# Altium schematic sheet FT2232HL_IN.SchDoc
size 297 x 209 mm; SheetNumber: 25; SheetTotal: 29
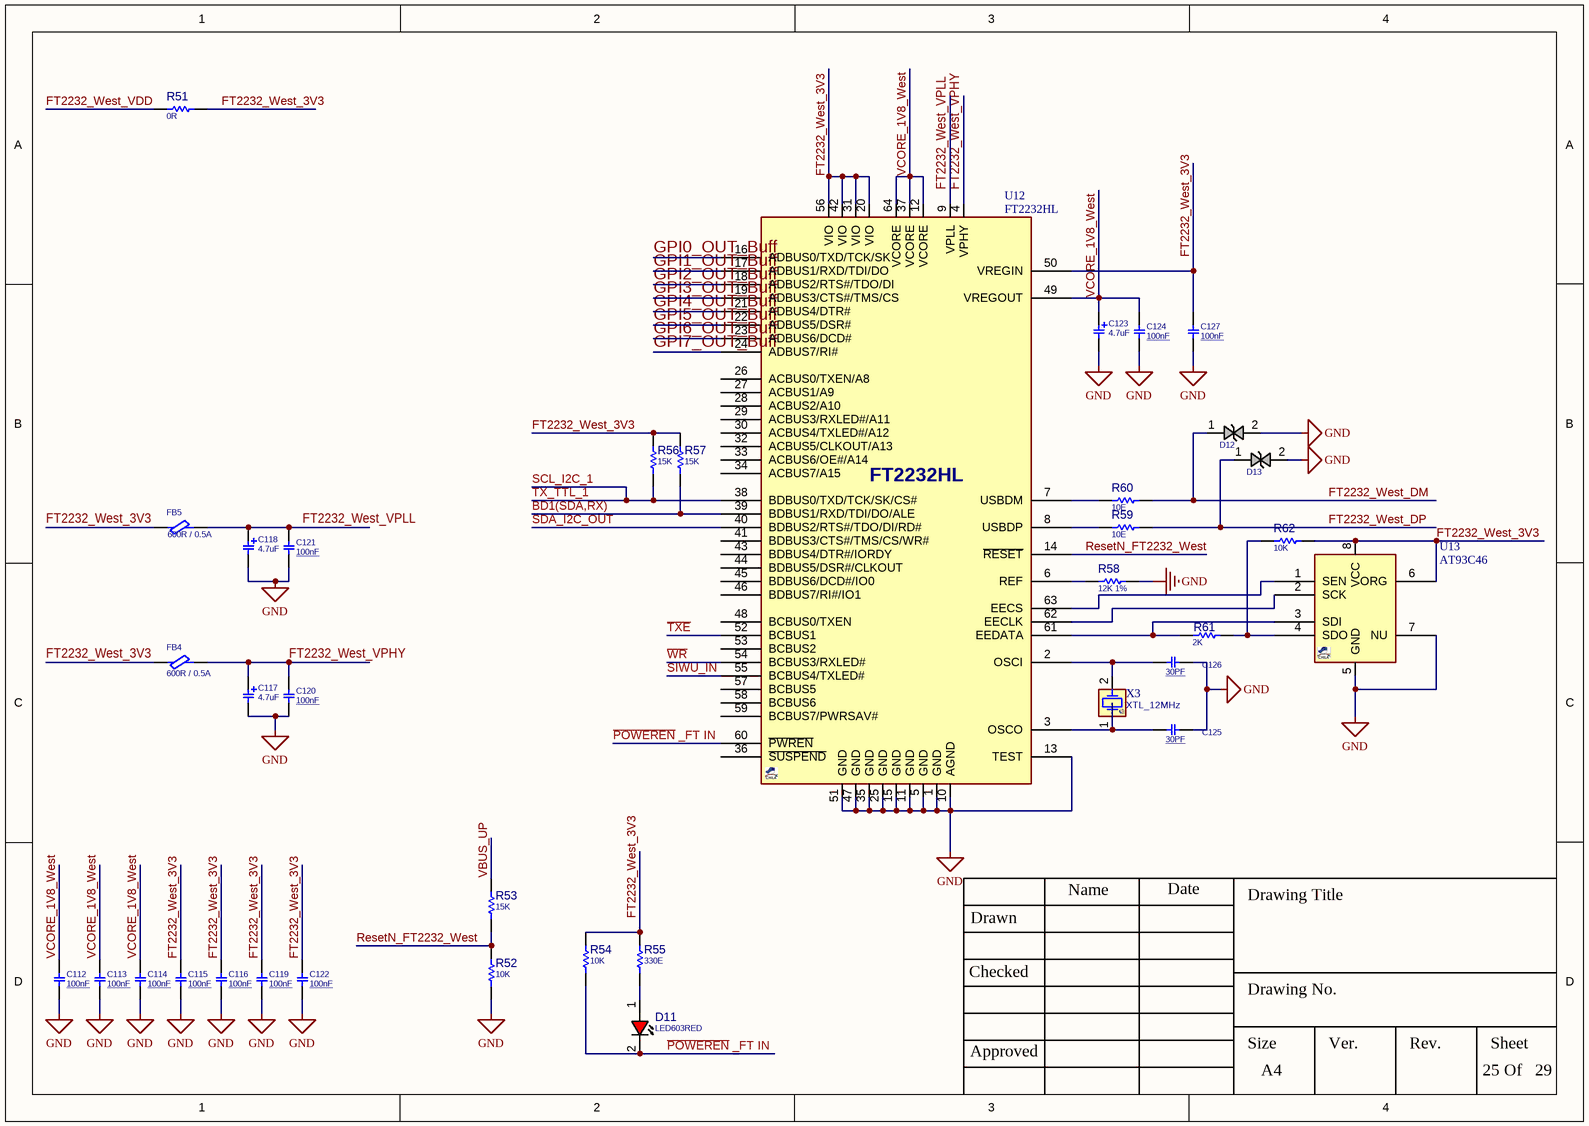
[diagram p0: FT2232HL_IN.SchDoc]

## Parts
C112  100nF  [0603]
C113  100nF  [0603]
C114  100nF  [0603]
C115  100nF  [0603]
C116  100nF  [0603]
C117  4.7uF  [C_TN_3216]
C118  4.7uF  [C_TN_3216]
C119  100nF  [0603]
C120  100nF  [0603]
C121  100nF  [0603]
C122  100nF  [0603]
C123  4.7uF  [C_TN_3216]
C124  100nF  [0603]
C125  30PF  [C0805]
C126  30PF  [C0805]
C127  100nF  [0603]
D11  LED603RED  [LED0603RED]
D12  TVS603  [D0603]  (value not drawn)
D13  TVS603  [D0603]  (value not drawn)
FB4  600R / 0.5A  [L0603]
FB5  600R / 0.5A  [L0603]
R51  0R  [R0603]
R52  10K  [R0603]
R53  15K  [R0603]
R54  10K  [R0603]
R55  330E  [R0603]
R56  15K  [R0603]
R57  15K  [R0603]
R58  value 12K 1%  [R025W_AX04]  (hidden comment: 12K)
R59  10E  [R0603]
R60  10E  [R0603]
R61  value 2K  [R025W_AX04]  (hidden comment: 12K)
R62  value 10K  [R025W_AX04]  (hidden comment: 12K)
U12  FT2232HL  [QFG50_64]
U13  AT93C46  [SO_8]
X3  XTL_12MHz  [XTL_2_11X5]

## Nets
GND: C112.2 C113.2 C114.2 C115.2 C116.2 C117.2 C118.2 C119.2 C120.2 C121.2 C122.2 C123.2 C124.2 C125.2 C126.2 C127.2 D12.2 D13.2 R52.2 R58.1 U12.1(GND) U12.5(GND) U12.10(AGND) U12.11(GND) U12.13(TEST) U12.15(GND) U12.25(GND) U12.35(GND) U12.47(GND) U12.51(GND) U13.5(GND) U13.7(NU)
~{POWEREN} _FT IN: D11.2(CATHODE) R54.2 U12.60(~{PWREN})
BD1(SDA,RX): R57.2 U12.39(BDBUS1/RXD/TDI/DO/ALE)
FT2232_West_3V3: C115.1 C116.1 C119.1 C122.1 C127.1 FB4.1 FB5.1 R51.2 R54.1 R55.1 R56.1 R57.1 R62.1 U12.20(VIO) U12.31(VIO) U12.42(VIO) U12.50(VREGIN) U12.56(VIO) U13.6(ORG) U13.8(VCC)
FT2232_West_DM: D12.1 R60.1
FT2232_West_DP: D13.1 R59.1
FT2232_West_VDD: R51.1
FT2232_West_VPHY: C117.1 C120.1 FB4.2 U12.4(VPHY)
FT2232_West_VPLL: C118.1 C121.1 FB5.2 U12.9(VPLL)
GPI0_OUT_Buff: U12.16(ADBUS0/TXD/TCK/SK)
GPI1_OUT_Buff: U12.17(ADBUS1/RXD/TDI/DO)
GPI2_OUT_Buff: U12.18(ADBUS2/RTS#/TDO/DI)
GPI3_OUT_Buff: U12.19(ADBUS3/CTS#/TMS/CS)
GPI4_OUT_Buff: U12.21(ADBUS4/DTR#)
GPI5_OUT_Buff: U12.22(ADBUS5/DSR#)
GPI6_OUT_Buff: U12.23(ADBUS6/DCD#)
GPI7_OUT_Buff: U12.24(ADBUS7/RI#)
ResetN_FT2232_West: R52.1 R53.2 U12.14(~{RESET})
SCL_I2C_1: R56.2 U12.38(BDBUS0/TXD/TCK/SK/CS#)  [also labelled TX_TTL_1]
SDA_I2C_OUT: U12.40(BDBUS2/RTS#/TDO/DI/RD#)
SIWU_IN: U12.55(BCBUS4/TXLED#)
~{TXE}: U12.52(BCBUS1)
VBUS_UP: R53.1
VCORE_1V8_West: C112.1 C113.1 C114.1 C123.1 C124.1 U12.12(VCORE) U12.37(VCORE) U12.49(VREGOUT) U12.64(VCORE)
~{WR}: U12.54(BCBUS3/RXLED#)
NetC125_1: C125.1 U12.3(OSCO) X3.1(OSC1)
NetC126_1: C126.1 U12.2(OSCI) X3.2(OSC2)
NetD11_1: D11.1(ANODE) R55.2
NetR58_2: R58.2 U12.6(REF)
NetR59_2: R59.2 U12.8(USBDP)
NetR60_2: R60.2 U12.7(USBDM)
NetR61_1: R61.1 R62.2 U13.4(SDO)
NetR61_2: R61.2 U12.61(EEDATA) U13.3(SDI)
NetU12_62: U12.62(EECLK) U13.2(SCK)
NetU12_63: U12.63(EECS) U13.1(SEN)

Not connected (* = marked no-connect by the designer): U12 26(ACBUS0/TXEN/A8) 27(ACBUS1/A9) 28(ACBUS2/A10) 29(ACBUS3/RXLED#/A11) 30(ACBUS4/TXLED#/A12) 32(ACBUS5/CLKOUT/A13) 33(ACBUS6/OE#/A14) 34(ACBUS7/A15) 36(~{SUSPEND}) 41(BDBUS3/CTS#/TMS/CS/WR#) 43(BDBUS4/DTR#/IORDY) 44(BDBUS5/DSR#/CLKOUT) 45(BDBUS6/DCD#/IO0) 46(BDBUS7/RI#/IO1) 48(BCBUS0/TXEN) 53(BCBUS2) 57(BCBUS5) 58(BCBUS6) 59(BCBUS7/PWRSAV#)

## Notes on the sheet
- Drawn
- Name
- Date
- Drawing Title
- Checked
- Drawing No.
- Approved
- Size
- A4
- Ver.
- Rev.
- Sheet
- Of

## Library data of the parts
C112-C116 C119-C122 C124 C127 = CAP_SMD_FILM_1u16v_1210: CAP, FILM, 1uF, 16V, Acryl, 20%, 1210; PARAM: Acrylic, MetallizedStacked, 20%, -40~85oC; MANF_P#: ECP-U1C105MA5; MANF: Panasonic; PRICE: 100= 36$; DESC: -; PARAM2: 16V; ASSEMBLY: ASSEMBLY; VALUE: 100nF
C117 C118 C123 = CAP_SMD_TAN_10uF_6.3V: CAP, SMD, TAN; PARAM: 20%, 300mOhm, -55~105oC; MANF: VISHAY; MANF_P#: T55A106M6R3C0300; PARAM2: 6.3V; PRICE: 0.46$; VALUE: 4.7uF
C125 C126 = CAP_SMD_MLCC: CAP, MLCC, 1nF, 50V, C0G, 10%, 0402; MANF: Murata; PARAM: C0G, 10%; PRICE: 100= 1.4$; DESC: -; MANF_P#: -; PARAM2: 50V; ASSEMBLY: ASSEMBLY; VALUE: 30PF
D11 = LED_SMD_0603_RED: LED, SMD, 0603, RED; PARAM: 30mA, 640nm; DESC: DESCRIPTION; MANF_P#: MANF_PART#; PARAM2: 1.8~2.5V; MANF: MANF; ASSEMBLY: ASSEMBLY; PRICE: PRICE; VALUE: LED603RED
D12 D13 = TVS_PGB0010603MR: TVS, ESD PROTECT, 24VDC, Bidirectional; MANF: LittelFuse; MANF_P#: PGB0010603MR; VALUE: TVS603
FB4 FB5 = FBEAD_SMD_MPZ1608S102: FERRITE_Bead, 0603, 0.8A, 300mOhm, 1000@100MHz; MANF: TDK; MANF_P#: MPZ1608S102ATA00; PARAM: 1000@100MHz; PARAM2: 0.8A; PRICE: 100= 3.4$; VALUE: 600R / 0.5A
R51-R57 R59 R60 = RES_SMD_0603: RESISTOR, SMD; PARAM: -W; DESC: DESCRIPTION; DIST#: MOUSER; PARAM2: 1%; MANF_P#: -; MANF: -; ASSEMBLY: ASSEMBLY; PRICE: 100= 0.5$
  R51: VALUE: 0R
  R52 R54: VALUE: 10K
  R53 R56 R57: VALUE: 15K
  R55: VALUE: 330E
  R59 R60: VALUE: 10E
R58 R61 R62 = RES_THD: RESISTOR, THD; MANF_P#: RK73H1ETTP4701F; MANF: KOA SPEER; PARAM: 0.063W; DESC: DESCRIPTION; DIST#: MOUSER; PARAM2: 1%; ASSEMBLY: ASSEMBLY; PRICE: 100= 0.5$
U12 = FT2232HL_QFP64: USB, DUAL, Multipurpose UART/FIFO, USB High Speed; MANF: FTDI; PARAM2: 3.3V; MANF_P#: FT2232HL; VALUE: FT2232HL
U13 = EEPROM_SPI_AT93C46_SOP8: EEPROM, SPI, 1KBIT, SOP-8; VALUE: AT93C46
X3 = XTL_2_HC49_8MHz_SMD: Crystal MOST POPULAR ABL HC49 PACKAGE; MANF: ABRACON; MANF_P#: ABLS-8.000MHZ-B4-T; PARAM: 8MHz, 18pF, 30PPM, -20~70oC; PRICE: 0.3$; VALUE: XTL_12MHz